# Altium schematic sheet USBCONN_C_16_FULL.SchDoc
size A3
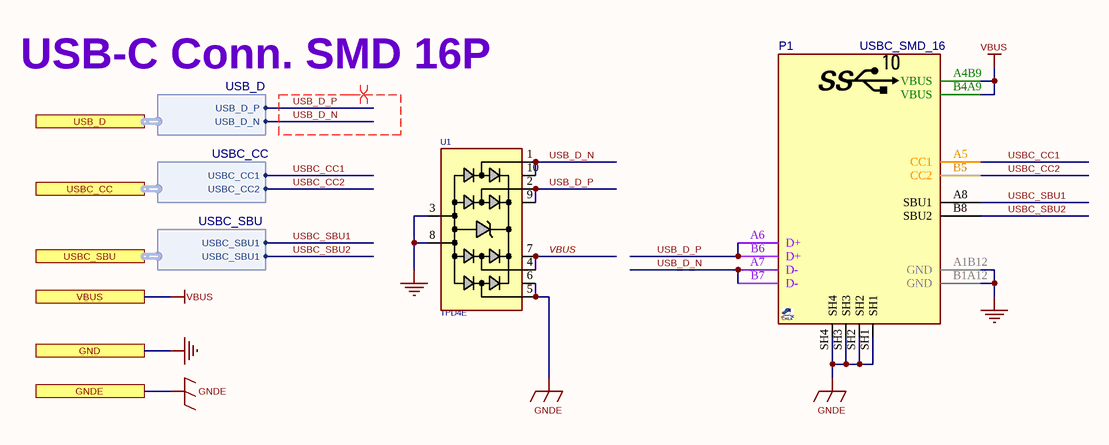
[diagram p0: USBCONN_C_16_FULL.SchDoc]

## Parts
P1  USBC_SMD_16  [USBC_SMD_16_2171790001]
U1  TPD4E  [SON50_10_2510E]

## Ports
GND, GNDE, USB_D (harness USB_D), USBC_CC (harness USBC_CC), USBC_SBU (harness USBC_SBU), VBUS

## Harnesses
USB_D: USB_D_P, USB_D_N
USBC_CC: USBC_CC1, USBC_CC2
USBC_SBU: USBC_SBU1, USBC_SBU1

## Nets
GND: P1.A1B12(GND) P1.B1A12(GND) U1.3 U1.8 ; port GND
GNDE: P1.SH1 P1.SH2 P1.SH3 P1.SH4 U1.5 U1.6 ; port GNDE
VBUS: P1.A4B9(VBUS) P1.B4A9(VBUS) U1.4 U1.7 ; port VBUS
USB_D_N: P1.A7(D-) P1.B7(D-) U1.1 U1.10 ; port USB_D.USB_D_N
USB_D_P: P1.A6(D+) P1.B6(D+) U1.2 U1.9 ; port USB_D.USB_D_P
USBC_CC1: P1.A5(CC1) ; port USBC_CC.USBC_CC1
USBC_CC2: P1.B5(CC2) ; port USBC_CC.USBC_CC2
USBC_SBU1: P1.A8(SBU1) P1.B8(SBU2) ; port USBC_SBU.USBC_SBU1  [also labelled USBC_SBU2]

## Layout directives
differential pair: USB_D_N, USB_D_P

## Notes on the sheet
- USB-C Conn. SMD 16P

## Library data of the parts
P1 = CONN_USBC_SMD_16_2171790001: CONN, USB, Type C, USB 2.0, Right-Angle, SMD; MANF: MOLEX; PARAM: 5A; Price: 1.5$; MANF_P#: 2171790001; Value: USBC_SMD_16
U1 = TVS_X4_TPD4E05U06: TVS, ESD PROTECT, 4CH,; MANF_P#: TPD4E05U06DQA; MANF: Texas Instruments; PARAM2: 6.5Vbr, 0.4pF, –40°~125°C; PARAM: ±12-kV ContactD, ±15-kVAirD; PRICE: 0.6$; VALUE: TPD4E